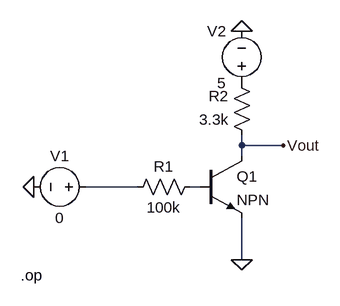
[diagram p0: schematic D4-DÇ1.asc]
D4-DÇ1.asc, the LTspice schematic file:
Version 4
SHEET 1 880 680
WIRE 272 64 272 48
WIRE 336 64 272 64
WIRE 272 80 272 64
WIRE 112 128 32 128
WIRE 208 128 192 128
WIRE 272 240 272 176
FLAG 272 240 0
FLAG 336 64 Vout
FLAG -48 128 0
FLAG 272 -112 0
SYMBOL res 208 112 R90
WINDOW 0 0 56 VBottom 2
WINDOW 3 32 56 VTop 2
SYMATTR InstName R1
SYMATTR Value 100k
SYMBOL res 288 64 R180
WINDOW 0 36 76 Left 2
WINDOW 3 36 40 Left 2
SYMATTR InstName R2
SYMATTR Value 3.3k
SYMBOL npn 208 80 R0
SYMATTR InstName Q1
SYMBOL voltage 48 128 R90
WINDOW 0 -32 56 VBottom 2
WINDOW 3 32 56 VTop 2
WINDOW 123 0 0 Left 0
WINDOW 39 0 0 Left 0
SYMATTR InstName V1
SYMATTR Value 0
SYMBOL voltage 272 -16 R180
WINDOW 0 24 96 Left 2
WINDOW 3 24 16 Left 2
WINDOW 123 0 0 Left 0
WINDOW 39 0 0 Left 0
SYMATTR InstName V2
SYMATTR Value 5
TEXT -68 264 Left 2 !.op

The netlist it stands for:
* D4-DÇ1.asc
R1 N002 N001 100k
R2 Vout P001 3.3k
Q1 Vout N002 0 0 NPN
V1 N001 0 0
V2 P001 0 5
.model NPN NPN
.model PNP PNP
.lib standard.bjt
.op
.backanno
.end